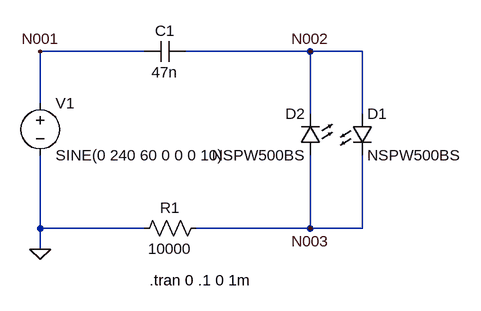
[diagram p0: schematic opto.asc]
opto.asc, the LTspice schematic file:
Version 4
SHEET 1 880 680
WIRE 32 128 -128 128
WIRE 288 128 96 128
WIRE 368 128 288 128
WIRE -128 208 -128 128
WIRE 288 224 288 128
WIRE 368 224 368 128
WIRE -128 400 -128 288
WIRE 32 400 -128 400
WIRE 288 400 288 288
WIRE 288 400 112 400
WIRE 368 400 368 288
WIRE 368 400 288 400
WIRE -128 432 -128 400
FLAG -128 432 0
FLAG 288 128 N002
FLAG -128 128 N001
FLAG 288 400 N003
SYMBOL LED 352 224 R0
SYMATTR InstName D1
SYMATTR Value NSPW500BS
SYMBOL LED 304 288 R180
WINDOW 0 24 64 Left 2
WINDOW 3 24 0 Left 2
SYMATTR InstName D2
SYMATTR Value NSPW500BS
SYMBOL cap 96 112 R90
WINDOW 0 0 32 VBottom 2
WINDOW 3 32 32 VTop 2
SYMATTR InstName C1
SYMATTR Value 47n
SYMATTR SpiceLine Rser=12.749 Lser=0 mfg="KEMET" pn="C2225C473KFRAC" type="X7R"
SYMBOL res 128 384 R90
WINDOW 0 0 56 VBottom 2
WINDOW 3 32 56 VTop 2
SYMATTR InstName R1
SYMATTR Value 10000
SYMBOL voltage -128 192 R0
SYMATTR InstName V1
SYMATTR Value SINE(0 240 60 0 0 0 10)
TEXT 40 480 Left 2 !.tran 0 .1 0 1m

The netlist it stands for:
* opto.asc
D1 N002 N003 NSPW500BS
D2 N003 N002 NSPW500BS
C1 N002 N001 47n Rser=12.749 Lser=0 mfg="KEMET" pn="C2225C473KFRAC" type="X7R"
R1 N003 0 10000
V1 N001 0 SINE(0 240 60 0 0 0 10)
.model D D
.lib standard.dio
.tran 0 .1 0 1m
.backanno
.end